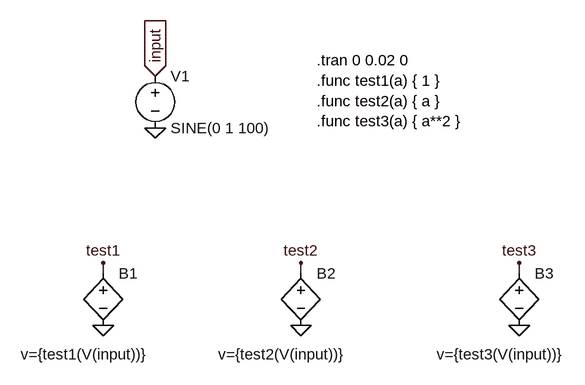
[diagram p0: schematic demo_11_0.asc]
demo_11_0.asc, the LTspice schematic file:
Version 4
SHEET 1 880 680
WIRE -80 464 -80 448
WIRE 224 464 224 448
WIRE 560 464 560 448
FLAG 0 240 0
FLAG 0 160 input
IOPIN 0 160 In
FLAG -80 544 0
FLAG -80 448 test1
FLAG 224 544 0
FLAG 224 448 test2
FLAG 560 544 0
FLAG 560 448 test3
SYMBOL voltage 0 144 R0
WINDOW 123 0 0 Left 0
WINDOW 39 0 0 Left 0
SYMATTR InstName V1
SYMATTR Value SINE(0 1 100)
SYMBOL bv -80 448 R0
WINDOW 3 -127 141 Left 2
SYMATTR Value v={test1(V(input))}
SYMATTR InstName B1
SYMBOL bv 224 448 R0
WINDOW 3 -127 141 Left 2
SYMATTR Value v={test2(V(input))}
SYMATTR InstName B2
SYMBOL bv 560 448 R0
WINDOW 3 -127 141 Left 2
SYMATTR Value v={test3(V(input))}
SYMATTR InstName B3
TEXT 248 136 Left 2 !.tran 0 0.02 0\n.func test1(a) { 1 }\n.func test2(a) { a }\n.func test3(a) { a**2 }

The netlist it stands for:
* demo_11_0.asc
V1 input 0 SINE(0 1 100)
B1 test1 0 v={test1(V(input))}
B2 test2 0 v={test2(V(input))}
B3 test3 0 v={test3(V(input))}
.tran 0 0.02 0
.func test1(a) { 1 }
.func test2(a) { a }
.func test3(a) { a**2 }
.backanno
.end

* Results of the author's LTspice run, read from the files saved beside the schematic
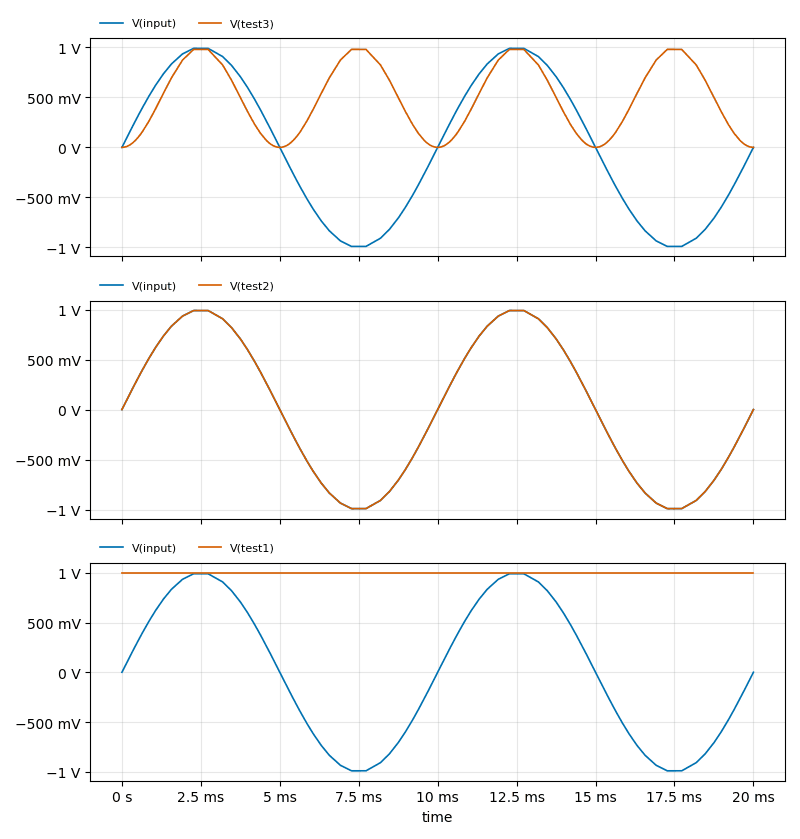
[diagram p1: Transient Analysis of demo_11_0.asc, plotted from the saved traces]
* Transient Analysis, 1 run:
*   V(input): min -989.7 mV, max 989.7 mV, average 0 V, rms 704.9 mV, last 0 V
*   V(test3): min 0 V, max 979.5 mV, average 496.9 mV, rms 609.2 mV, last 0 V
*   V(input): min -989.7 mV, max 989.7 mV, average 0 V, rms 704.9 mV, last 0 V
*   V(test2): min -989.7 mV, max 989.7 mV, average 0 V, rms 704.9 mV, last 0 V
*   V(input): min -989.7 mV, max 989.7 mV, average 0 V, rms 704.9 mV, last 0 V
*   V(test1): min 1 V, max 1 V, average 1 V, rms 1 V, last 1 V